# Altium schematic sheet Main Board.SchDoc: Main Board
size A4; Date: 2016/01/06; Author: Samuel López; DocumentNumber: 1; SheetNumber: 1; SheetTotal: 7; Project: H2H Main Board
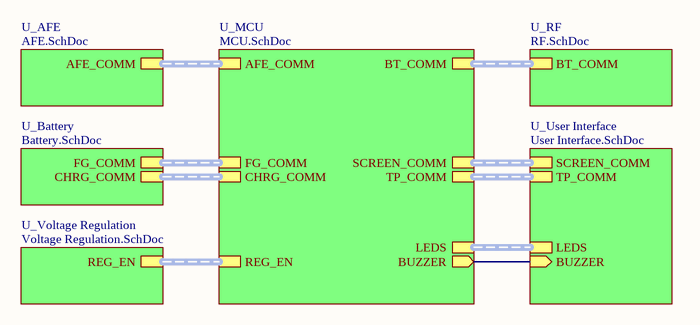
[diagram p0: Main Board.SchDoc]

## Sub-sheets
U_AFE = AFE.SchDoc: AFE_COMM (harness AFE_COMM)
U_Battery = Battery.SchDoc: FG_COMM (harness FG_COMM), CHRG_COMM (harness CHRG_COMM)
U_MCU = MCU.SchDoc: SCREEN_COMM (harness SCREEN_COMM), AFE_COMM (harness AFE_COMM), FG_COMM (harness FG_COMM), CHRG_COMM (harness CHRG_COMM), REG_EN (harness REG_EN), BT_COMM (harness BT_COMM), TP_COMM (harness TP_COMM), LEDS (harness LEDS), BUZZER (out)
U_RF = RF.SchDoc: BT_COMM (harness BT_COMM)
U_User Interface = User Interface.SchDoc: SCREEN_COMM (harness SCREEN_COMM), TP_COMM (harness TP_COMM), LEDS (harness LEDS), BUZZER (in)
U_Voltage Regulation = Voltage Regulation.SchDoc: REG_EN (harness REG_EN)

## Nets
(unnamed): sheet U_User Interface/BUZZER, sheet U_MCU/BUZZER

## Buses and harness runs
harness sheet U_AFE/AFE_COMM = sheet U_MCU/AFE_COMM
harness sheet U_Battery/CHRG_COMM = sheet U_MCU/CHRG_COMM
harness sheet U_Battery/FG_COMM = sheet U_MCU/FG_COMM
harness sheet U_MCU/BT_COMM = sheet U_RF/BT_COMM
harness sheet U_MCU/LEDS = sheet U_User Interface/LEDS
harness sheet U_MCU/REG_EN = sheet U_Voltage Regulation/REG_EN
harness sheet U_MCU/SCREEN_COMM = sheet U_User Interface/SCREEN_COMM
harness sheet U_MCU/TP_COMM = sheet U_User Interface/TP_COMM

## Notes on the sheet
- Project:
- Title:
- Sheet
- Author:
- of
- Date: